# Altium schematic sheet JoyStickAdcInput.SchDoc
size A4
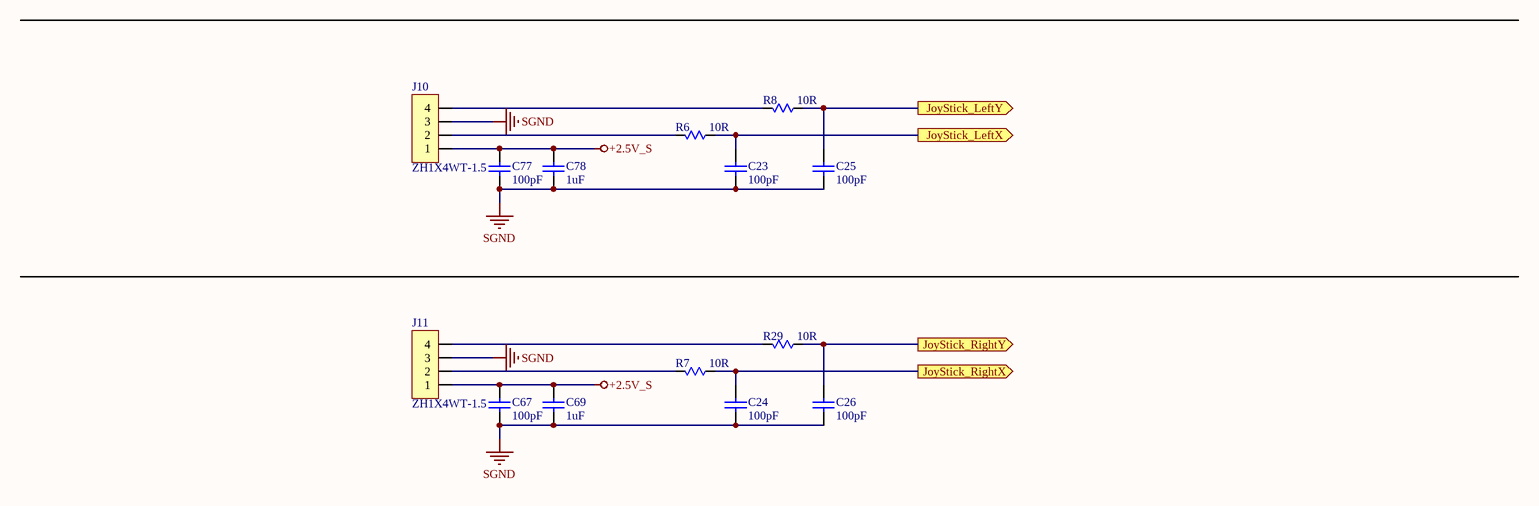
[diagram p0: JoyStickAdcInput.SchDoc]

## Parts
C23  100pF  [C0805]
C24  100pF  [C0805]
C25  100pF  [C0805]
C26  100pF  [C0805]
C67  100pF  [C0805]
C69  1uF  [C0805]
C77  100pF  [C0805]
C78  1uF  [C0805]
J10  ZH1X4WT-1.5  [ZH1X4WT-1.5]
J11  ZH1X4WT-1.5  [ZH1X4WT-1.5]
R6  10R  [R0805]
R7  10R  [R0805]
R8  10R  [R0805]
R29  10R  [R0805]

## Ports
JoyStick_LeftX (out), JoyStick_LeftY (out), JoyStick_RightX (out), JoyStick_RightY (out)

## Nets
+2.5V_S: C67.1 C69.1 C77.1 C78.1 J10.1 J11.1
SGND: C23.2 C24.2 C25.2 C26.2 C67.2 C69.2 C77.2 C78.2 J10.3 J11.3
JoyStick_LeftX: C23.1 R6.1 ; port JoyStick_LeftX
JoyStick_LeftY: C25.1 R8.1 ; port JoyStick_LeftY
JoyStick_RightX: C24.1 R7.1 ; port JoyStick_RightX
JoyStick_RightY: C26.1 R29.1 ; port JoyStick_RightY
NetJ10_2: J10.2 R6.2
NetJ10_4: J10.4 R8.2
NetJ11_2: J11.2 R7.2
NetJ11_4: J11.4 R29.2

## Library data of the parts
C23-C26 C67 C69 C77 C78 = Cap: Capacitor; Value: 22pF; Published: 8-Jun-2000; Revision: July-2002: Re-released for DXP Platform.; Publisher: Altium Limited
J10 J11 = HEADER1X4
R6-R8 R29 = RES: Resistor; Published: 8-Jun-2000; LatestRevisionDate: 17-Jul-2002; LatestRevisionNote: Re-released for DXP Platform.; PackageReference: AXIAL-0.3; Publisher: Altium Limited; Value: 10R